# EAGLE design bvm (EAGLE 8.1.0)
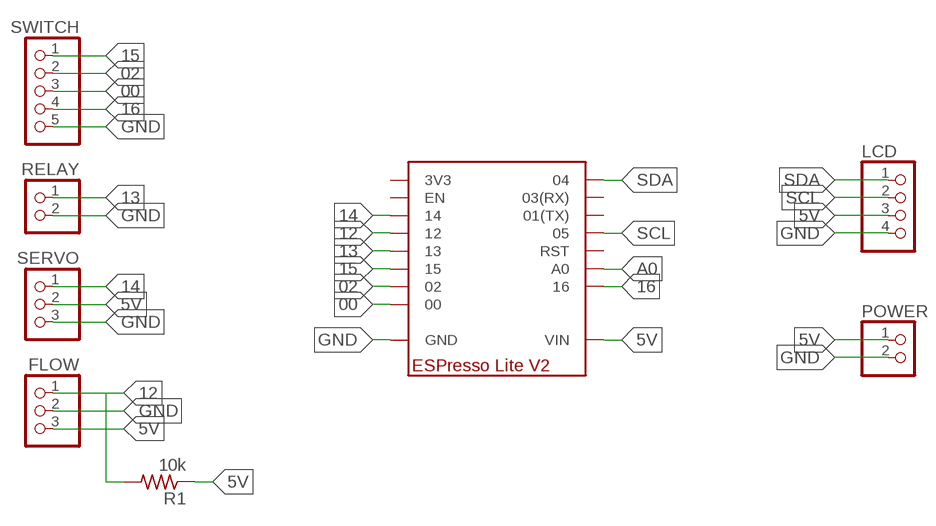
[diagram p0: schematic, sheet 1]

## Parts
FLOW  PINHD-1X3  [1X03]
LCD  PINHD-1X4  [1X04]
POWER  PINHD-1X2  [1X02]
R1  10k  R-US_0207/10  [0207/10]
RELAY  PINHD-1X2  [1X02]
SERVO  PINHD-1X3  [1X03]
SWITCH  PINHD-1X5  [1X05]
U$1  ESPRESSO-LITE-V2  [ESPRESSO-LITE-V2]

## Nets
00: SWITCH.3 U$1.00
02: SWITCH.2 U$1.02
5V: FLOW.3 LCD.3 POWER.1 R1.1 SERVO.2 U$1.VIN1(VIN) U$1.VIN2(VIN)
12: FLOW.1 R1.2 U$1.12
13: RELAY.1 U$1.13
14: SERVO.1 U$1.14
15: SWITCH.1 U$1.15
16: SWITCH.4 U$1.16
A0: U$1.AO(A0)
GND: FLOW.2 LCD.4 POWER.2 RELAY.2 SERVO.3 SWITCH.5 U$1.GND1(GND) U$1.GND2(GND) U$1.GND3(GND)
SCL: LCD.2 U$1.05
SDA: LCD.1 U$1.04
Unconnected: U$1.01(01(TX)) U$1.03(03(RX)) U$1.3V3 U$1.EN U$1.RST

## Library data of the parts
FLOW SERVO = pinhead:PINHD-1X3: PIN HEADER
LCD = pinhead:PINHD-1X4: PIN HEADER
POWER RELAY = pinhead:PINHD-1X2: PIN HEADER
R1 = adafruit:R-US_: RESISTOR, American symbol
SWITCH = pinhead:PINHD-1X5: PIN HEADER
U$1 = cmmc_lbr1:ESPRESSO-LITE-V2

## Board
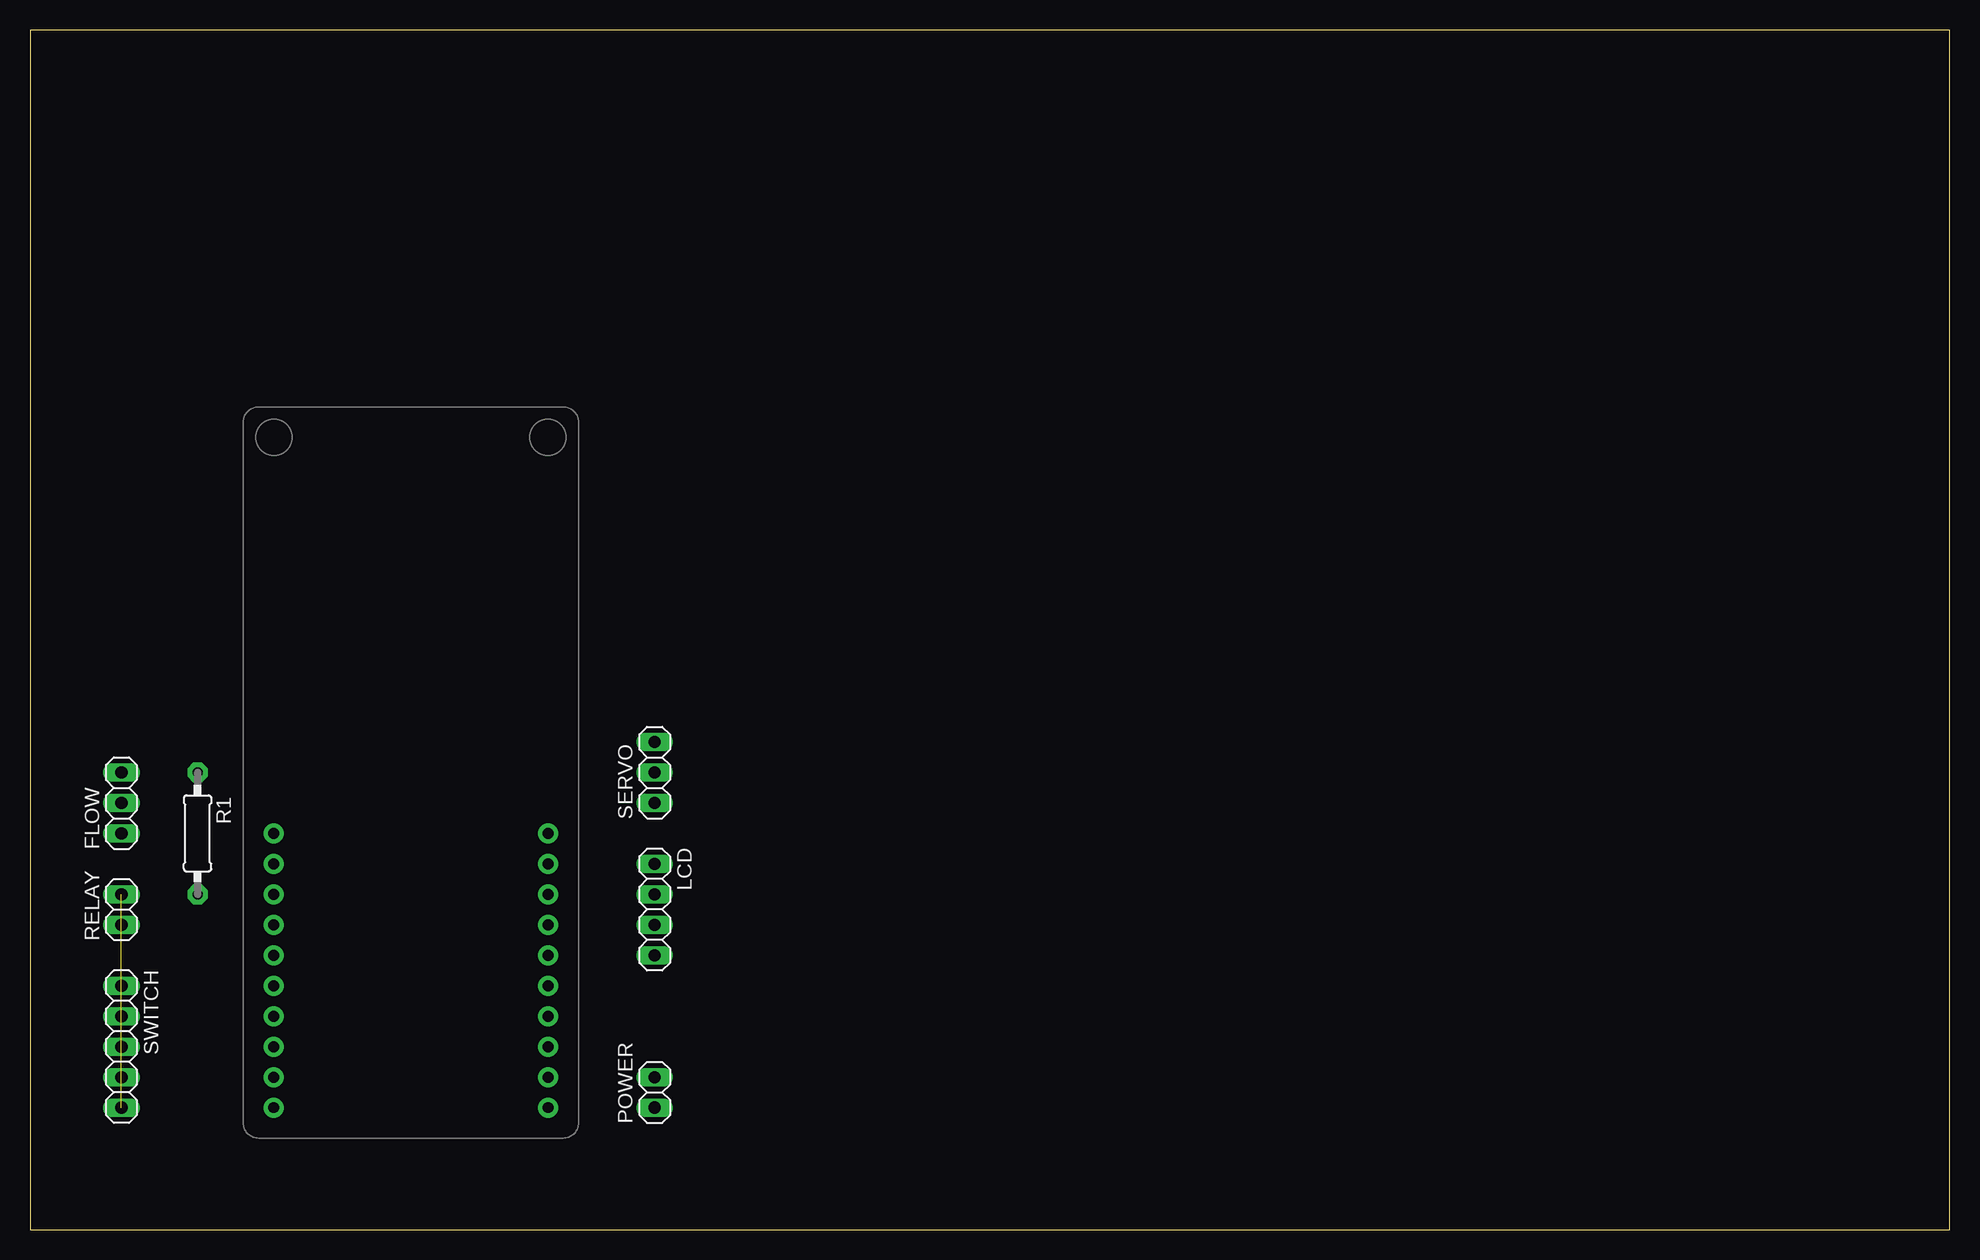
[diagram p1: board, top side]
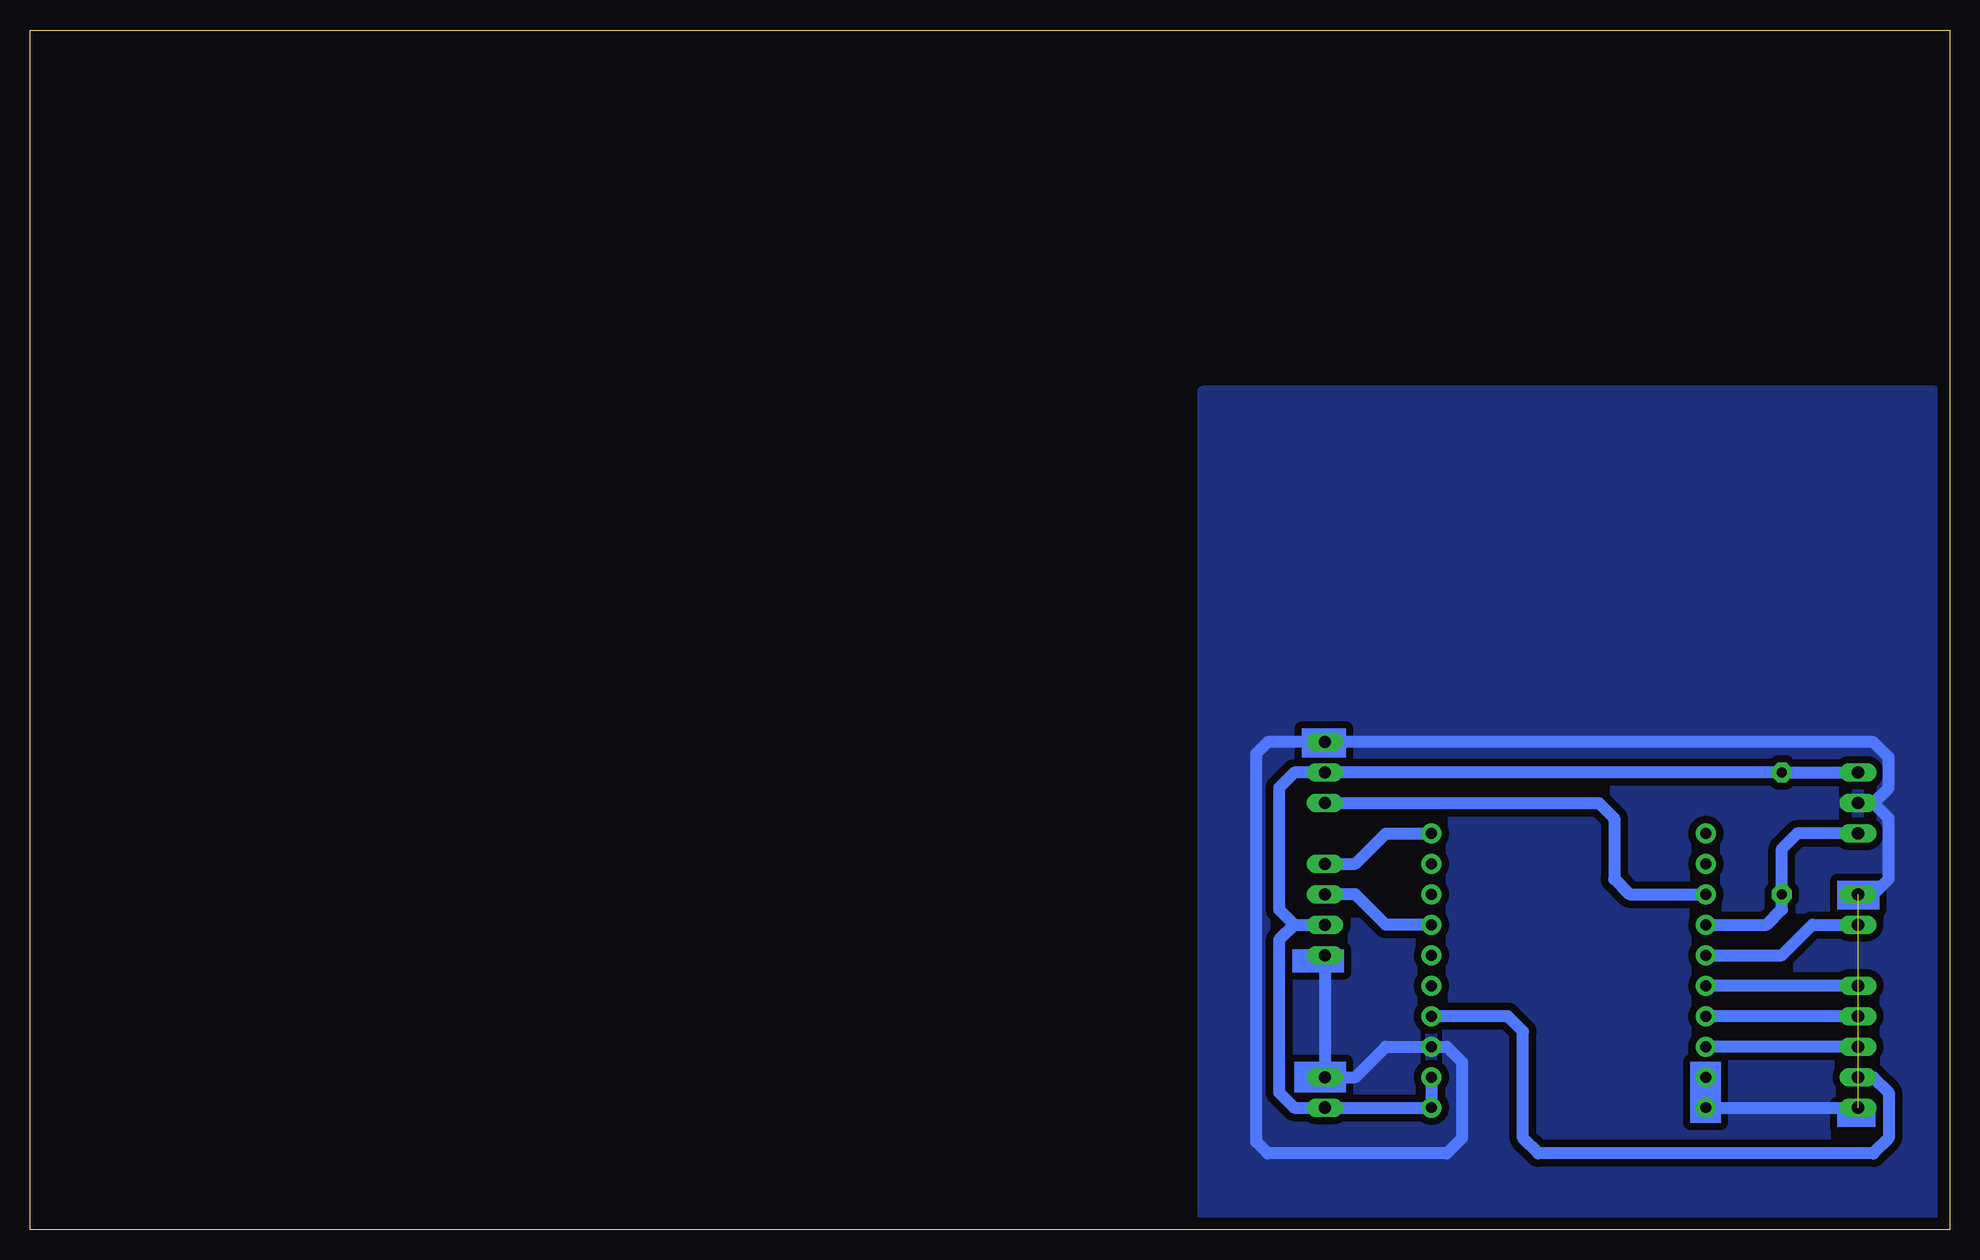
[diagram p2: board, bottom side, seen from below]

Size 160 x 100 mm. Coordinates in mm from the lower left corner, seen from the top.
Outline: 0,0 160,0 160,100 0,100 0,0
Copper layers (1*16): Top 0.035mm / dielectric 1.5mm / Bottom 0.035mm
Design rules "default": minimum track width 10mil, minimum drill 24mil, track to track 8mil, track to pad 8mil, pad to pad 8mil, via to via 8mil, smd to smd 8mil, copper to edge 40mil, drill to drill 8mil, minimum pad ring 10mil, minimum via ring 8mil, stop-mask expansion 4mil, vias tented up to drill 0mil, thermal gap 10mil

### Footprints (pad centres in the part's own frame; a part is rotated, then mirrored left to right if it is on the bottom)
1X03 = drill 1.016 long: 1 -2.54,0; 2 0,0; 3 2.54,0
1X04 = drill 1.016 long: 1 -3.81,0; 2 -1.27,0; 3 1.27,0; 4 3.81,0
1X02 = drill 1.016 long: 1 -1.27,0; 2 1.27,0
0207/10 = drill 0.813 pad 1.676 octagon: 1 -5.08,0; 2 5.08,0
1X05 = drill 1.016 long: 1 -5.08,0; 2 -2.54,0; 3 0,0; 4 2.54,0; 5 5.08,0
ESPRESSO-LITE-V2 = drill 0.9 pad 1.676: 00 2.54,7.62; 01 25.4,20.32; 02 2.54,10.16; 03 25.4,22.86; 3V3 2.54,25.4; 04 25.4,25.4; 05 25.4,17.78; 12 2.54,17.78; 13 2.54,15.24; 14 2.54,20.32; 15 2.54,12.7; 16 25.4,10.16; AO 25.4,12.7; EN 2.54,22.86; GND1 2.54,2.54; GND2 2.54,5.08; GND3 25.4,7.62; RST 25.4,15.24; VIN1 25.4,2.54; VIN2 25.4,5.08

### Placement (x,y rotation side)
FLOW  7.62,35.56 90 top
LCD  52.07,26.67 270 top
POWER  52.07,11.43 90 top
R1  13.97,33.02 270 top
RELAY  7.62,26.67 90 top
SERVO  52.07,38.1 90 top
SWITCH  7.62,15.24 270 top
U$1  17.78,7.62 0 top

### Tracks (layer width: path | path; a pad name or v marks a point on that pad's centre or on a via)
00
  Bottom 1.016: SWITCH.3 U$1.00
02
  Bottom 1.016: SWITCH.2 U$1.02
5V
  Bottom 1.016: U$1.VIN2 U$1.VIN1 POWER.1 54.61,10.16 55.88,11.43 55.88,24.13 54.61,25.4 | 54.61,25.4 LCD.3 | FLOW.3 R1.1 SERVO.2 | SERVO.2 53.34,38.1 | SERVO.2 54.61,38.1 55.88,36.83 55.88,26.67 54.61,25.4
12
  Bottom 1.016: FLOW.1 12.7,33.02 13.97,31.75 R1.2 13.97,26.67 15.24,25.4 U$1.12
13
  Bottom 1.016: U$1.13 13.97,22.86 11.43,25.4 RELAY.1
14
  Bottom 1.016: SERVO.1 29.21,35.56 27.94,34.29 27.94,29.21 26.67,27.94 U$1.14
15
  Bottom 1.016: SWITCH.1 U$1.15
16
  Bottom 1.016: SWITCH.4 6.35,12.7 5.08,11.43 5.08,7.62 6.35,6.35 34.29,6.35 35.56,7.62 35.56,16.51 36.83,17.78 U$1.16
GND  (1 unrouted)
  Bottom 1.016: U$1.GND2 U$1.GND1 SWITCH.5 | LCD.4 POWER.2 49.53,12.7 46.99,15.24 U$1.GND3 41.91,15.24 40.64,13.97 40.64,7.62 41.91,6.35 56.83,6.35 57.78,7.3 57.78,39.69 56.83,40.64 SERVO.3 6.35,40.64 5.08,39.37 5.08,36.83 6.35,35.56 | 6.35,35.56 FLOW.2 | RELAY.2 6.35,27.94 5.08,29.21 5.08,34.29 6.35,35.56
  pour Bottom (isolate 0.61): 1.27,69.85 62.23,69.85 62.23,1.27 1.27,1.27
SCL
  Bottom 1.016: U$1.05 46.99,25.4 49.53,27.94 LCD.2
SDA
  Bottom 1.016: LCD.1 49.53,30.48 46.99,33.02 U$1.04
(copper drawn outside any net)
  shapes: Bottom area x7